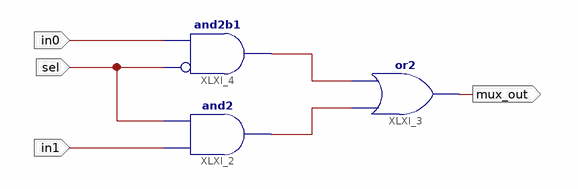
[diagram p0: schematic sheet 1]
// Xilinx ISE schematic mux_2to1.sch (spartan3e) as structural Verilog: 3 symbols, 4 ports
module mux_2to1 (
  input  in0,
  input  sel,
  input  in1,
  output mux_out
);

  wire XLXN_1, XLXN_2;

  and XLXI_2 (XLXN_2, in1, sel);
  or XLXI_3 (mux_out, XLXN_2, XLXN_1);
  and XLXI_4 (XLXN_1, ~sel, in0);  // and2b1
endmodule
